# EAGLE design hidrosonico (EAGLE 7.3.0)
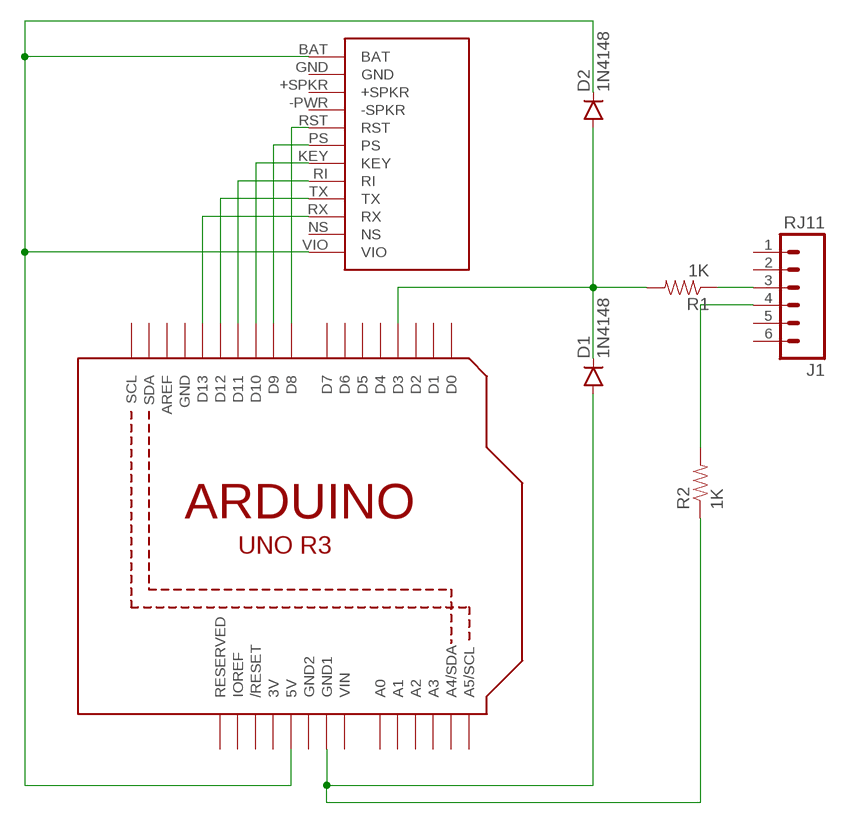
[diagram p0: schematic, sheet 1]

## Parts
D1  1N4148  DIODE1N4148  [DIODE-1N4148]
D2  1N4148  DIODE1N4148  [DIODE-1N4148]
J1  RJ11  RJ11-6PTH  [RJ11-6]
R1  1K  RESISTORPTH-1/2W  [AXIAL-0.5]
R2  1K  RESISTORPTH-1/2W  [AXIAL-0.5]
U1  ARDUINOR3-DIMENSION  [ARDUINOR3]
U$1  ADAFRUIT_FONA  [FONA]

## Nets
KEY: U1.D10 U$1.KEY
N$2: U1.D9 U$1.PS
N$8: J1.3 R1.P$1
N$9: D1.A R2.P$1 U1.GND1
N$10: D1.C D2.A R1.P$2 U1.D3
N$12: J1.4 R2.P$2
PWR: D2.C U1.5V U$1.BAT U$1.VIO
RI: U1.D11 U$1.RI
RST: U1.D8 U$1.RST
RX: U1.D13 U$1.RX
TX: U1.D12 U$1.TX
Unconnected: J1.1 J1.2 J1.5 J1.6 U1.A0 U1.A1 U1.A2 U1.A3 U1.A4(A4/SDA) U1.A5(A5/SCL) U1.AREF U1.D0 U1.D1 U1.D2 U1.D4 U1.D5 U1.D6 U1.D7 U1.IOREF U1.RESERVED U1.RESET(/RESET) U1.SCL U1.SDA U$1.+SPKR U$1.-PWR(-SPKR) U$1.NS

## Power pins joined to a net without a drawn wire
3V: U1.3V
GND: U1.GND U$1.GND
GND2: U1.GND2
VIN: U1.VIN

## Library data of the parts
D1 D2 = SparkFun-DiscreteSemi:DIODE: Diode These are standard reverse protection diodes and small signal diodes. SMA package can handle up to about 1A. SOD-323 can handle about 200mA. What the SOD-323 package when ordering, there are some mfgs out there that are 5-pin packages.
J1 = SparkFun-Connectors:RJ11-6: RJ11 Jack Simple 6 pin RJ11 jack. Commonly found on CAT3 devices and Microchip programmers. SKU: PRT-00132; PROD_ID: CONN-08590
R1 R2 = SparkFun-Passives:RESISTOR: Resistor Basic schematic elements and footprints for 0603, 1206, and PTH resistors.
U1 = adafruit:ARDUINOR3: This is a new object for the new Arduino R3 - with extra pins that you may want to use (such as IOref, and duplicated A4/A5
U$1 = dai-maker-lab:ADAFRUIT_FONA

## Board
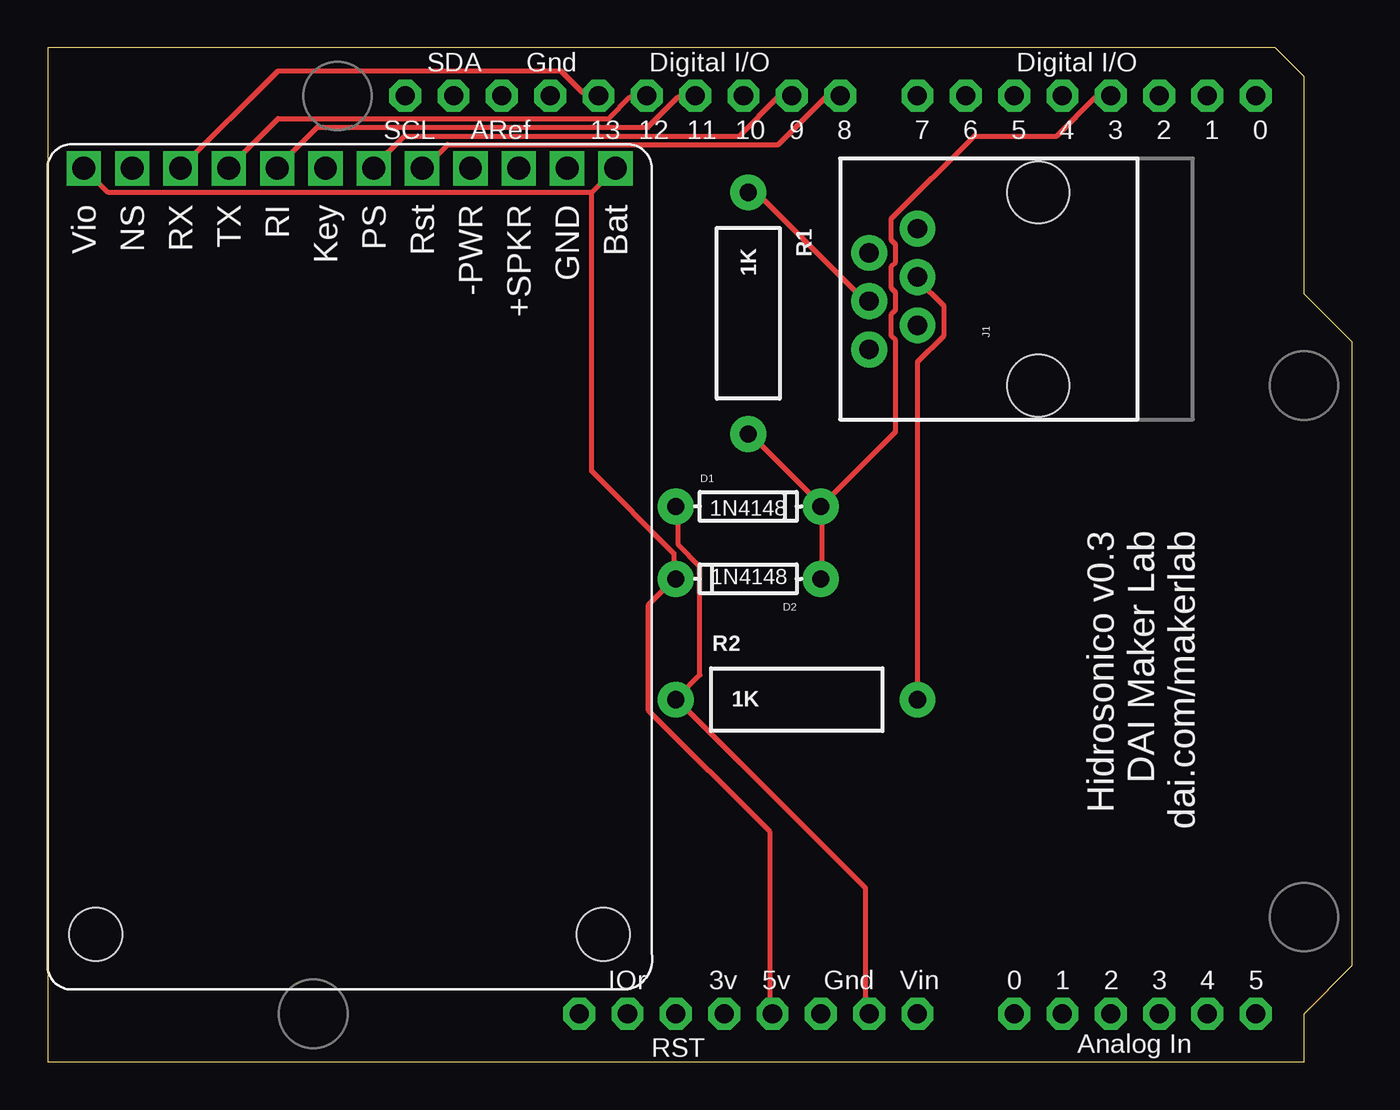
[diagram p1: board, top side]
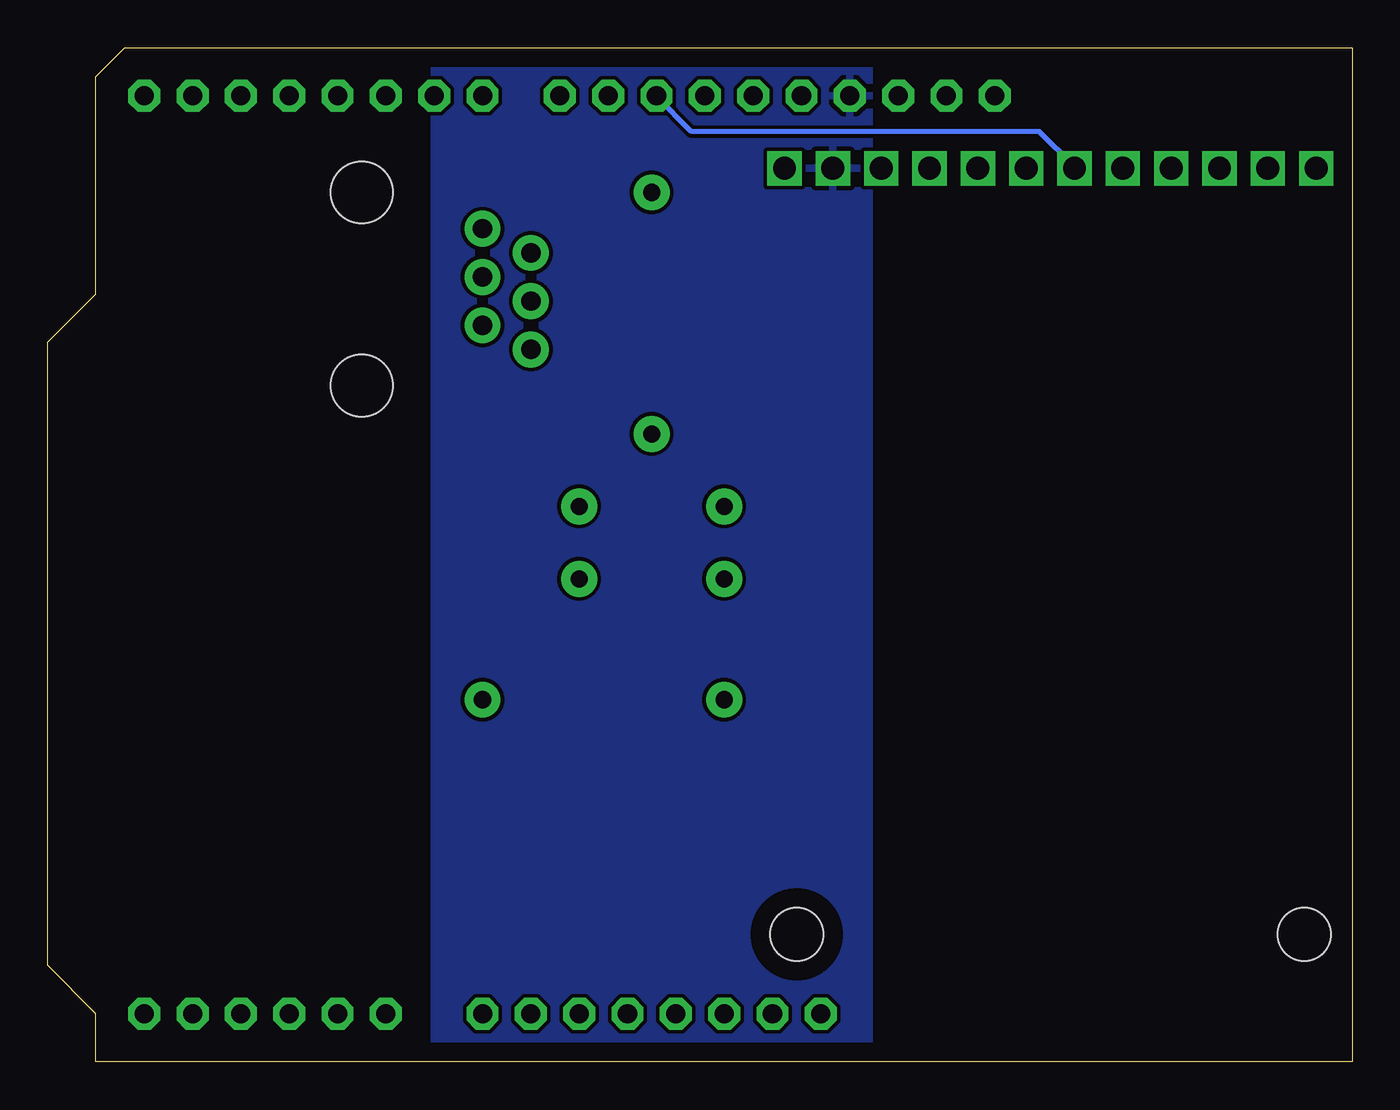
[diagram p2: board, bottom side, seen from below]

Size 68.58 x 53.34 mm. Coordinates in mm from the lower left corner, seen from the top.
Outline: 58.42,53.34 58.09,53.33
Copper layers (1*16): Top 0.035mm / dielectric 1.5mm / Bottom 0.035mm
Design rules "default": minimum track width 10mil, minimum drill 24mil, track to track 8mil, track to pad 8mil, pad to pad 8mil, via to via 8mil, smd to smd 8mil, copper to edge 40mil, drill to drill 8mil, minimum pad ring 10mil, minimum via ring 8mil, stop-mask expansion 4mil, vias tented up to drill 0mil, thermal gap 10mil

### Footprints (pad centres in the part's own frame; a part is rotated, then mirrored left to right if it is on the bottom)
DIODE-1N4148 = drill 0.9 pad 1.88: A -3.81,0; C 3.81,0
RJ11-6 = drill 1.016 pad 1.88: 1 -3.175,8.89; 2 -1.905,6.35; 3 -0.635,8.89; 4 0.635,6.35; 5 1.905,8.89; 6 3.175,6.35 | hole 3.251: -5.08,0; 5.08,0
AXIAL-0.5 = drill 0.9 pad 1.88: P$1 -6.35,0; P$2 6.35,0
ARDUINOR3 = drill 1 pad 1.676 octagon: 3V 35.56,2.54; 5V 38.1,2.54; A0 50.8,2.54; A1 53.34,2.54; A2 55.88,2.54; A3 58.42,2.54; A4 60.96,2.54; A5 63.5,2.54; AREF 23.876,50.8; D0 63.5,50.8; D1 60.96,50.8; D2 58.42,50.8; D3 55.88,50.8; D4 53.34,50.8; D5 50.8,50.8; D6 48.26,50.8; D7 45.72,50.8; D8 41.656,50.8; D9 39.116,50.8; D10 36.576,50.8; D11 34.036,50.8; D12 31.496,50.8; D13 28.956,50.8; GND 26.416,50.8; GND1 43.18,2.54; GND2 40.64,2.54; IOREF 30.48,2.54; RESERVED 27.94,2.54; RESET 33.02,2.54; SCL 18.796,50.8; SDA 21.336,50.8; VIN 45.72,2.54
FONA = drill 1.2 square: +SPKR 6.985,1.27; -PWR 9.525,1.27; BAT 1.905,1.27; GND 4.445,1.27; KEY 17.145,1.27; NS 27.305,1.27; PS 14.605,1.27; RI 19.685,1.27; RST 12.065,1.27; RX 24.765,1.27; TX 22.225,1.27; VIO 29.845,1.27 | hole 2.8: 2.54,41.545; 29.21,41.545

### Placement (x,y rotation side)
D1  36.83,29.21 0 top
D2  36.83,25.4 180 top
J1  52.07,40.64 90 top
R1  36.83,39.37 270 top
R2  39.37,19.05 0 top
U1  0,0 0 top
U$1  31.75,48.26 180 top

### Tracks (layer width: path | path; a pad name or v marks a point on that pad's centre or on a via)
GND
  pour Bottom: 25.4,53.34 25.4,0 48.26,0 48.26,53.34
KEY
  Bottom 0.254: U1.D10 36.58,50.75 34.75,48.92 16.46,48.92 14.63,47.09 U$1.KEY
N$2
  Top 0.254: U1.D9 39.09,50.75 38.41,50.75 36.35,48.69 18.75,48.69 17.14,47.09 U$1.PS
N$8
  Top 0.254: R1.P$1 37.26,45.72 42.98,40.01 J1.3
N$9
  Top 0.254: U1.GND1 42.98,2.74 42.98,9.14 33.15,18.97 R2.P$1 33.15,19.2 34.29,20.34 34.29,26.06 33.15,27.2 33.15,29.03 D1.A
N$10
  Top 0.254: 40.69,29.26 44.58,33.15 44.58,37.95 44.35,38.18 44.35,39.32 44.58,39.55 44.58,40.46 44.35,40.69 44.35,41.83 44.58,42.06 44.58,42.98 44.35,43.2 44.35,44.35 48.69,48.69 53.03,48.69 55.09,50.75 55.78,50.75 U1.D3 | D2.A 40.69,25.6 40.69,29.03 D1.C 40.69,29.26 | 40.69,29.26 37.03,32.92 R1.P$2
N$12
  Top 0.254: R2.P$2 45.72,36.8 47.09,38.18 47.09,39.78 45.72,41.15 J1.4
PWR
  Top 0.254: U1.5V 37.95,2.74 37.95,12.12 31.55,18.52 31.55,24 32.92,25.38 D2.C 32.92,25.6 32.92,26.75 28.57,31.09 28.57,45.72 | 28.57,45.72 3.2,45.72 2.06,46.86 U$1.VIO | U$1.BAT 28.57,45.72
RI
  Top 0.254: U1.D11 33.83,50.75 33.15,50.75 31.55,49.15 14.17,49.15 12.12,47.09 U$1.RI
RST
  Top 0.254: U1.D8 41.6,50.75 40.92,50.75 38.41,48.23 21.03,48.23 19.89,47.09 U$1.RST
RX
  Top 0.254: U$1.RX 12.12,52.12 26.98,52.12 28.12,50.98 28.8,50.98 U1.D13
TX
  Top 0.254: U1.D12 31.32,50.75 30.63,50.75 29.49,49.61 12.12,49.61 9.6,47.09 U$1.TX

### Text on the board
tPlace: Hidrosonico v0.3 / DAI Maker Lab / dai.com/makerlab